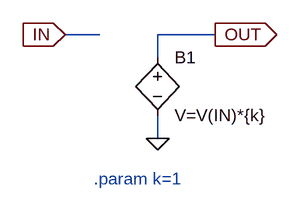
[diagram p0: schematic Gain.asc]
Gain.asc, the LTspice schematic file:
Version 4
SHEET 1 880 680
WIRE 64 128 16 128
WIRE 224 128 144 128
WIRE 144 160 144 128
WIRE 144 272 144 240
FLAG 16 128 IN
IOPIN 16 128 In
FLAG 224 128 OUT
IOPIN 224 128 Out
FLAG 144 272 0
SYMBOL bv 144 144 R0
SYMATTR InstName B1
SYMATTR Value V=V(IN)*{k}
TEXT 56 328 Left 0 ;.param k=1

The netlist it stands for:
* Gain.asc
B1 OUT 0 V=V(IN)*{k}
* .param k=1
.backanno
.end